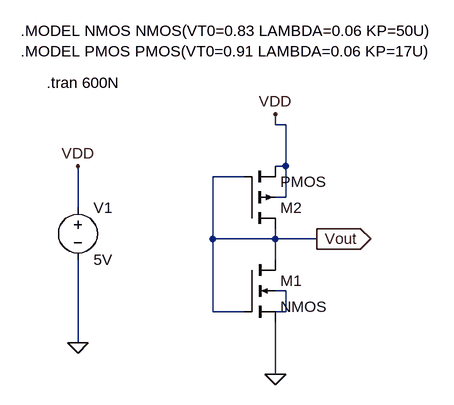
[diagram p0: schematic CMOS_Potential Divider.asc]
CMOS_Potential Divider.asc, the LTspice schematic file:
Version 4
SHEET 1 880 680
WIRE 128 -48 128 -64
WIRE 144 -48 128 -48
WIRE 144 16 144 -48
WIRE 144 16 128 16
WIRE 80 32 32 32
WIRE 144 64 144 16
WIRE 144 64 128 64
WIRE -176 80 -176 16
WIRE 32 128 32 32
WIRE 128 128 128 112
WIRE 128 128 32 128
WIRE 192 128 128 128
WIRE 128 160 128 128
WIRE 144 208 128 208
WIRE 32 240 32 128
WIRE 80 240 32 240
WIRE 144 240 144 208
WIRE 144 240 128 240
WIRE -176 288 -176 160
WIRE 128 336 128 256
FLAG -176 288 0
FLAG -176 16 VDD
FLAG 128 -64 VDD
FLAG 192 128 Vout
IOPIN 192 128 Out
FLAG 128 336 0
SYMBOL nmos4 80 160 R0
SYMATTR InstName M1
SYMATTR Value2 l=5 w=15
SYMBOL pmos4 80 112 M180
SYMATTR InstName M2
SYMATTR Value2 l=5 w=15
SYMBOL voltage -176 64 R0
WINDOW 123 0 0 Left 2
WINDOW 39 0 0 Left 2
SYMATTR InstName V1
SYMATTR Value 5V
TEXT -264 -192 Left 2 !.MODEL NMOS NMOS(VT0=0.83 LAMBDA=0.06 KP=50U)\n.MODEL PMOS PMOS(VT0=0.91 LAMBDA=0.06 KP=17U)
TEXT -224 -112 Left 2 !.tran 600N

The netlist it stands for:
* CMOS_Potential Divider.asc
M1 Vout Vout 0 N001 NMOS l=5 w=15
M2 Vout Vout VDD VDD PMOS l=5 w=15
V1 VDD 0 5V
.model NMOS NMOS
.model PMOS PMOS
.lib standard.mos
.MODEL NMOS NMOS(VT0=0.83 LAMBDA=0.06 KP=50U)
.MODEL PMOS PMOS(VT0=0.91 LAMBDA=0.06 KP=17U)
.tran 600N
.backanno
.end